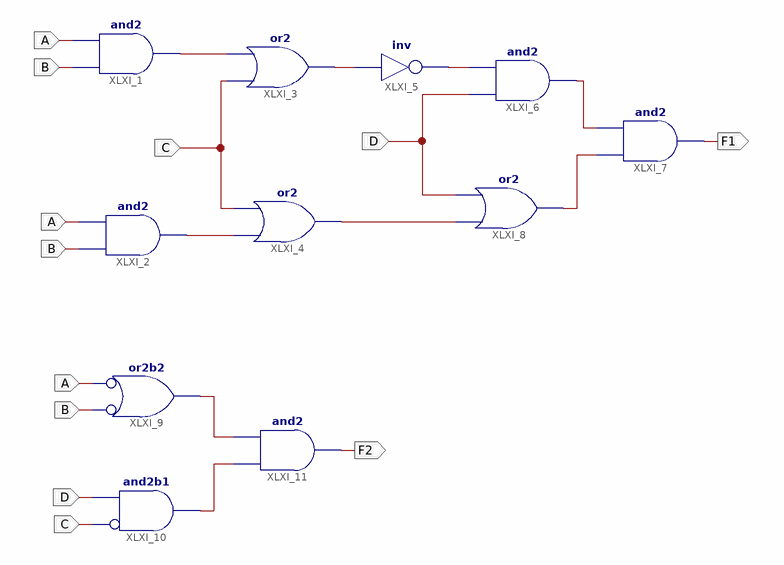
[diagram p0: schematic sheet 1]
// Xilinx ISE schematic Lab_2_1.sch (spartan3e) as structural Verilog: 11 symbols, 6 ports
module Lab_2_1 (
  input  C,
  input  D,
  input  A,
  input  B,
  output F1,
  output F2
);

  wire XLXN_1, XLXN_4, XLXN_5, XLXN_6, XLXN_7, XLXN_10, XLXN_11, XLXN_17, XLXN_18;

  and XLXI_1 (XLXN_1, B, A);
  and XLXI_2 (XLXN_4, B, A);
  or XLXI_4 (XLXN_5, XLXN_4, C);
  not XLXI_5 (XLXN_7, XLXN_6);
  and XLXI_6 (XLXN_11, D, XLXN_7);
  and XLXI_7 (F1, XLXN_10, XLXN_11);
  or XLXI_8 (XLXN_10, XLXN_5, D);
  or XLXI_3 (XLXN_6, C, XLXN_1);
  or XLXI_9 (XLXN_17, ~B, ~A);  // or2b2
  and XLXI_10 (XLXN_18, ~C, D);  // and2b1
  and XLXI_11 (F2, XLXN_18, XLXN_17);
endmodule
